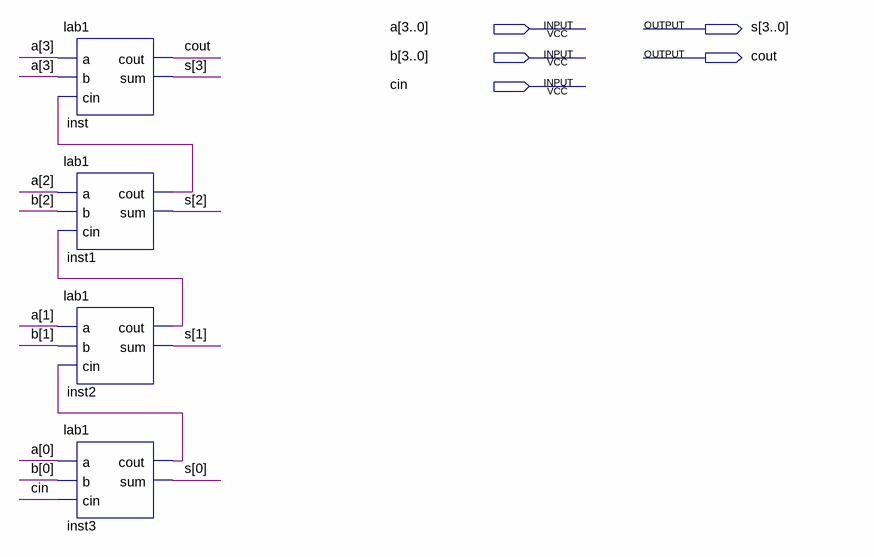
[diagram p0: schematic sheet]
// Quartus schematic 4bitRCA.bdf as structural Verilog: 4 symbols, 5 pins
module \4bitRCA  (
  input  [3:0] a,
  input  [3:0] b,
  input  cin,
  output [3:0] s,
  output cout
);

  wire inst1_cout, inst2_cout, inst3_cout;

  lab1 inst (.a(a[3]), .b(a[3]), .cin(inst1_cout), .cout(cout), .sum(s[3]));
  lab1 inst1 (.a(a[2]), .b(b[2]), .cin(inst2_cout), .cout(inst1_cout), .sum(s[2]));
  lab1 inst2 (.a(a[1]), .b(b[1]), .cin(inst3_cout), .cout(inst2_cout), .sum(s[1]));
  lab1 inst3 (.a(a[0]), .b(b[0]), .cin(cin), .cout(inst3_cout), .sum(s[0]));
endmodule
